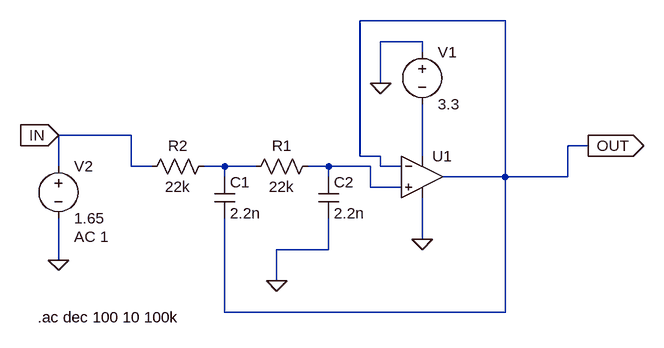
[diagram p0: schematic sallen_key_ltspice_lab.asc]
sallen_key_ltspice_lab.asc, the LTspice schematic file:
Version 4.1
SHEET 1 880 680
WIRE 400 -112 176 -112
WIRE 272 -80 208 -80
WIRE 272 -64 272 -80
WIRE 208 -16 208 -80
WIRE -176 64 -288 64
WIRE 528 80 496 80
WIRE 176 96 176 -112
WIRE 208 96 176 96
WIRE 272 96 272 16
WIRE -288 112 -288 64
WIRE -176 112 -176 64
WIRE -144 112 -176 112
WIRE -32 112 -64 112
WIRE 16 112 -32 112
WIRE 128 112 96 112
WIRE 192 112 128 112
WIRE 208 112 208 96
WIRE 240 112 208 112
WIRE -32 128 -32 112
WIRE 128 128 128 112
WIRE 400 128 400 -112
WIRE 400 128 304 128
WIRE 496 128 496 80
WIRE 496 128 400 128
WIRE 192 144 192 112
WIRE 240 144 192 144
WIRE 272 224 272 160
WIRE 128 240 128 192
WIRE 128 240 48 240
WIRE -288 256 -288 192
WIRE 48 288 48 240
WIRE -32 336 -32 192
WIRE 400 336 400 128
WIRE 400 336 -32 336
FLAG 48 288 0
FLAG 272 224 0
FLAG 208 -16 0
FLAG -288 256 0
FLAG 528 80 OUT
IOPIN 528 80 Out
FLAG -288 64 IN
IOPIN -288 64 In
SYMBOL res 112 96 R90
WINDOW 0 0 56 VBottom 2
WINDOW 3 32 56 VTop 2
SYMATTR InstName R1
SYMATTR Value 22k
SYMBOL res -48 96 R90
WINDOW 0 0 56 VBottom 2
WINDOW 3 32 56 VTop 2
SYMATTR InstName R2
SYMATTR Value 22k
SYMBOL cap -48 128 R0
SYMATTR InstName C1
SYMATTR Value 2.2n
SYMBOL OpAmps\\UniversalOpAmp2 272 128 R0
SYMATTR InstName U1
SYMBOL cap 112 128 R0
SYMATTR InstName C2
SYMATTR Value 2.2n
SYMBOL voltage 272 -80 R0
WINDOW 123 0 0 Left 0
WINDOW 39 0 0 Left 0
SYMATTR InstName V1
SYMATTR Value 3.3
SYMBOL voltage -288 96 R0
WINDOW 123 24 124 Left 2
WINDOW 39 0 0 Left 0
SYMATTR InstName V2
SYMATTR Value 1.65
SYMATTR Value2 AC 1
TEXT -320 344 Left 2 !.ac dec 100 10 100k

The netlist it stands for:
* sallen_key_ltspice_lab.asc
R1 N003 N002 22k
R2 N002 IN 22k
C1 N002 OUT 2.2n
X§U1 N003 OUT N001 0 OUT level2 Avol=1Meg GBW=10Meg Slew=10Meg Ilimit=25m Rail=0 Vos=0 En=0 Enk=0 In=0 Ink=0 Rin=500Meg  ; pins In+ In- V+ V- OUT
C2 N003 0 2.2n
V1 0 N001 3.3
V2 IN 0 1.65 AC 1
.ac dec 100 10 100k
.lib UniversalOpAmp2.lib
.backanno
.end